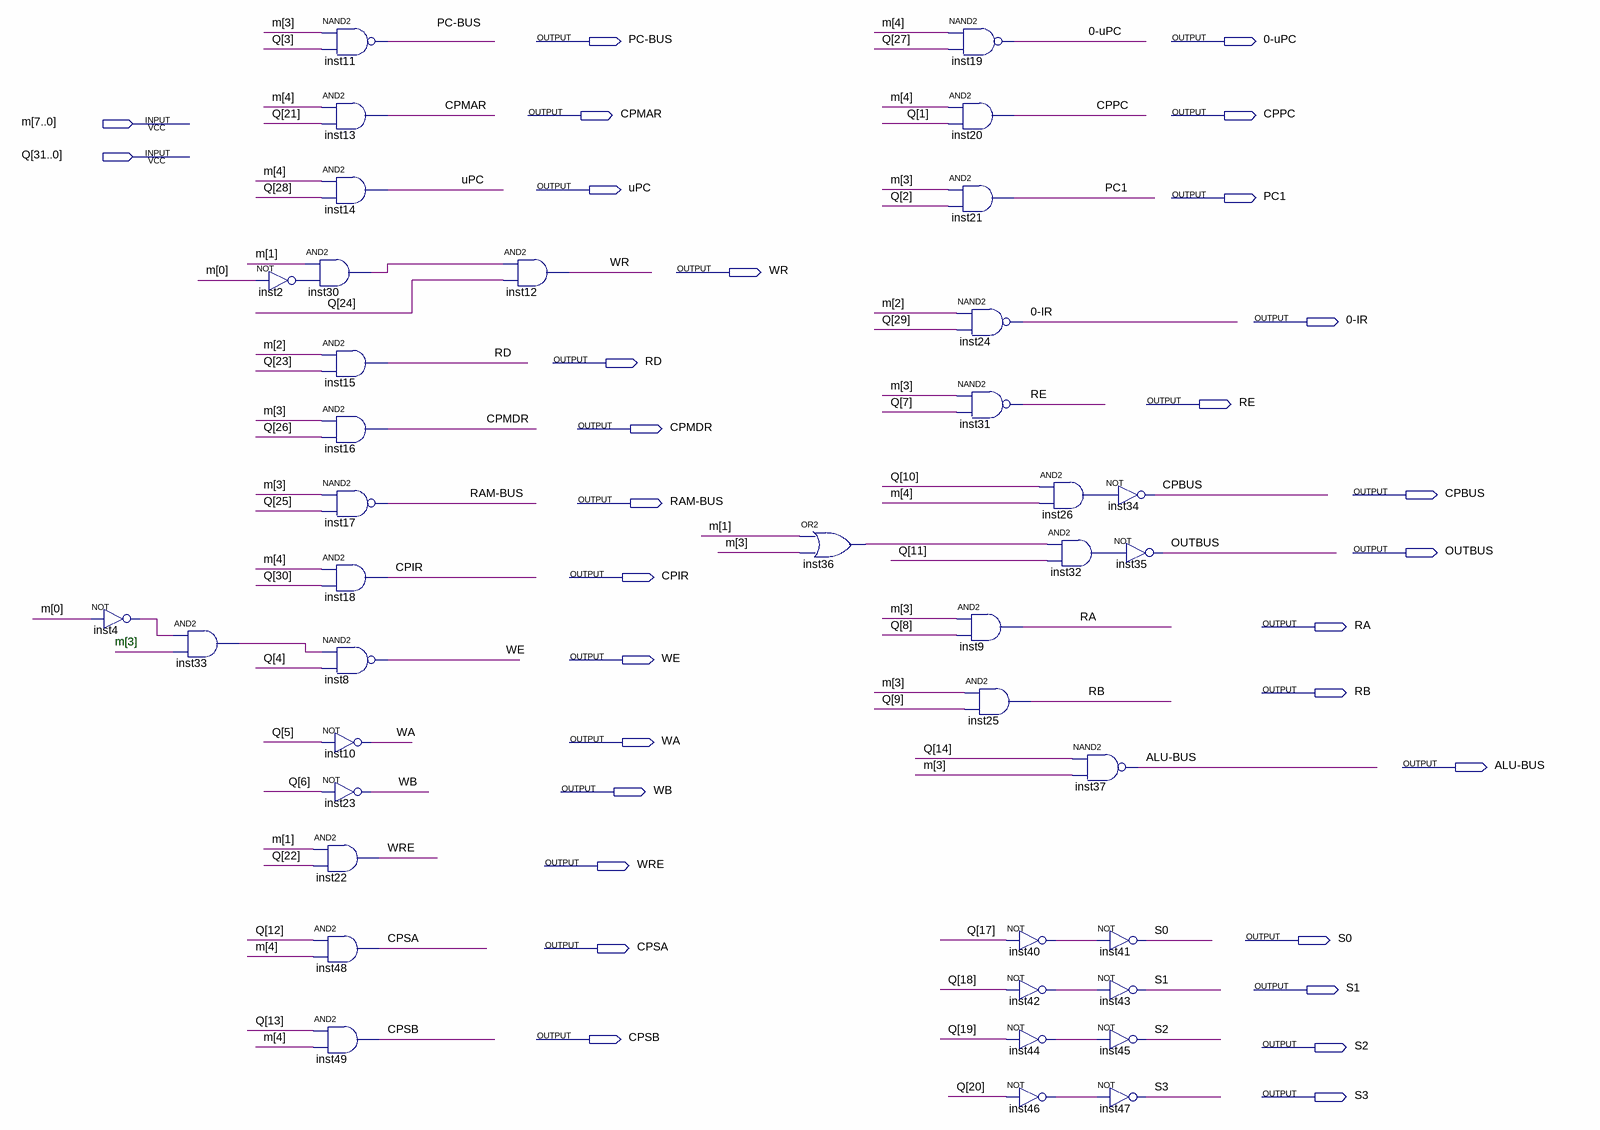
[diagram p0: schematic sheet]
// Quartus schematic CU_controller.bdf as structural Verilog: 39 symbols, 30 pins
module CU_controller (
  input  [7:0] m,
  input  [31:0] Q,
  output \PC-BUS ,
  output \0-uPC ,
  output CPMAR,
  output CPPC,
  output uPC,
  output PC1,
  output WR,
  output \0-IR ,
  output RD,
  output RE,
  output CPMDR,
  output CPBUS,
  output \RAM-BUS ,
  output OUTBUS,
  output CPIR,
  output RA,
  output WE,
  output RB,
  output WA,
  output \ALU-BUS ,
  output WB,
  output WRE,
  output S0,
  output CPSA,
  output S1,
  output CPSB,
  output S2,
  output S3
);

  wire inst2_out, inst4_out, inst26_out, inst30_out, inst32_out, inst33_out, inst36_out, inst40_out,
       inst42_out, inst44_out, inst46_out;

  not inst4 (inst4_out, m[0]);
  and inst33 (inst33_out, inst4_out, m[3]);
  not inst2 (inst2_out, m[0]);
  nand inst11 (\PC-BUS , m[3], Q[3]);
  and inst13 (CPMAR, m[4], Q[21]);
  and inst14 (uPC, m[4], Q[28]);
  and inst30 (inst30_out, m[1], inst2_out);
  and inst15 (RD, m[2], Q[23]);
  and inst16 (CPMDR, m[3], Q[26]);
  nand inst17 (\RAM-BUS , m[3], Q[25]);
  and inst18 (CPIR, m[4], Q[30]);
  nand inst8 (WE, inst33_out, Q[4]);
  not inst10 (WA, Q[5]);
  not inst23 (WB, Q[6]);
  and inst22 (WRE, m[1], Q[22]);
  and inst48 (CPSA, Q[12], m[4]);
  and inst49 (CPSB, Q[13], m[4]);
  and inst12 (WR, inst30_out, Q[24]);
  or inst36 (inst36_out, m[1], m[3]);
  nand inst19 (\0-uPC , m[4], Q[27]);
  and inst20 (CPPC, m[4], Q[1]);
  and inst21 (PC1, m[3], Q[2]);
  nand inst24 (\0-IR , m[2], Q[29]);
  nand inst31 (RE, m[3], Q[7]);
  and inst9 (RA, m[3], Q[8]);
  and inst25 (RB, m[3], Q[9]);
  and inst26 (inst26_out, Q[10], m[4]);
  and inst32 (inst32_out, inst36_out, Q[11]);
  not inst40 (inst40_out, Q[17]);
  not inst42 (inst42_out, Q[18]);
  not inst44 (inst44_out, Q[19]);
  not inst46 (inst46_out, Q[20]);
  not inst34 (CPBUS, inst26_out);
  not inst35 (OUTBUS, inst32_out);
  nand inst37 (\ALU-BUS , Q[14], m[3]);
  not inst41 (S0, inst40_out);
  not inst43 (S1, inst42_out);
  not inst45 (S2, inst44_out);
  not inst47 (S3, inst46_out);

  // Notes on the sheet:
  //   m[3]
endmodule
